# Altium schematic sheet ADC_LED_Monitor.SchDoc: ADC Led Monitor
size Tabloid; Date: 05/10/2023; Engineer: Terry D. Schevker; Revision: 1.0; SheetNumber: 2; SheetTotal: 7
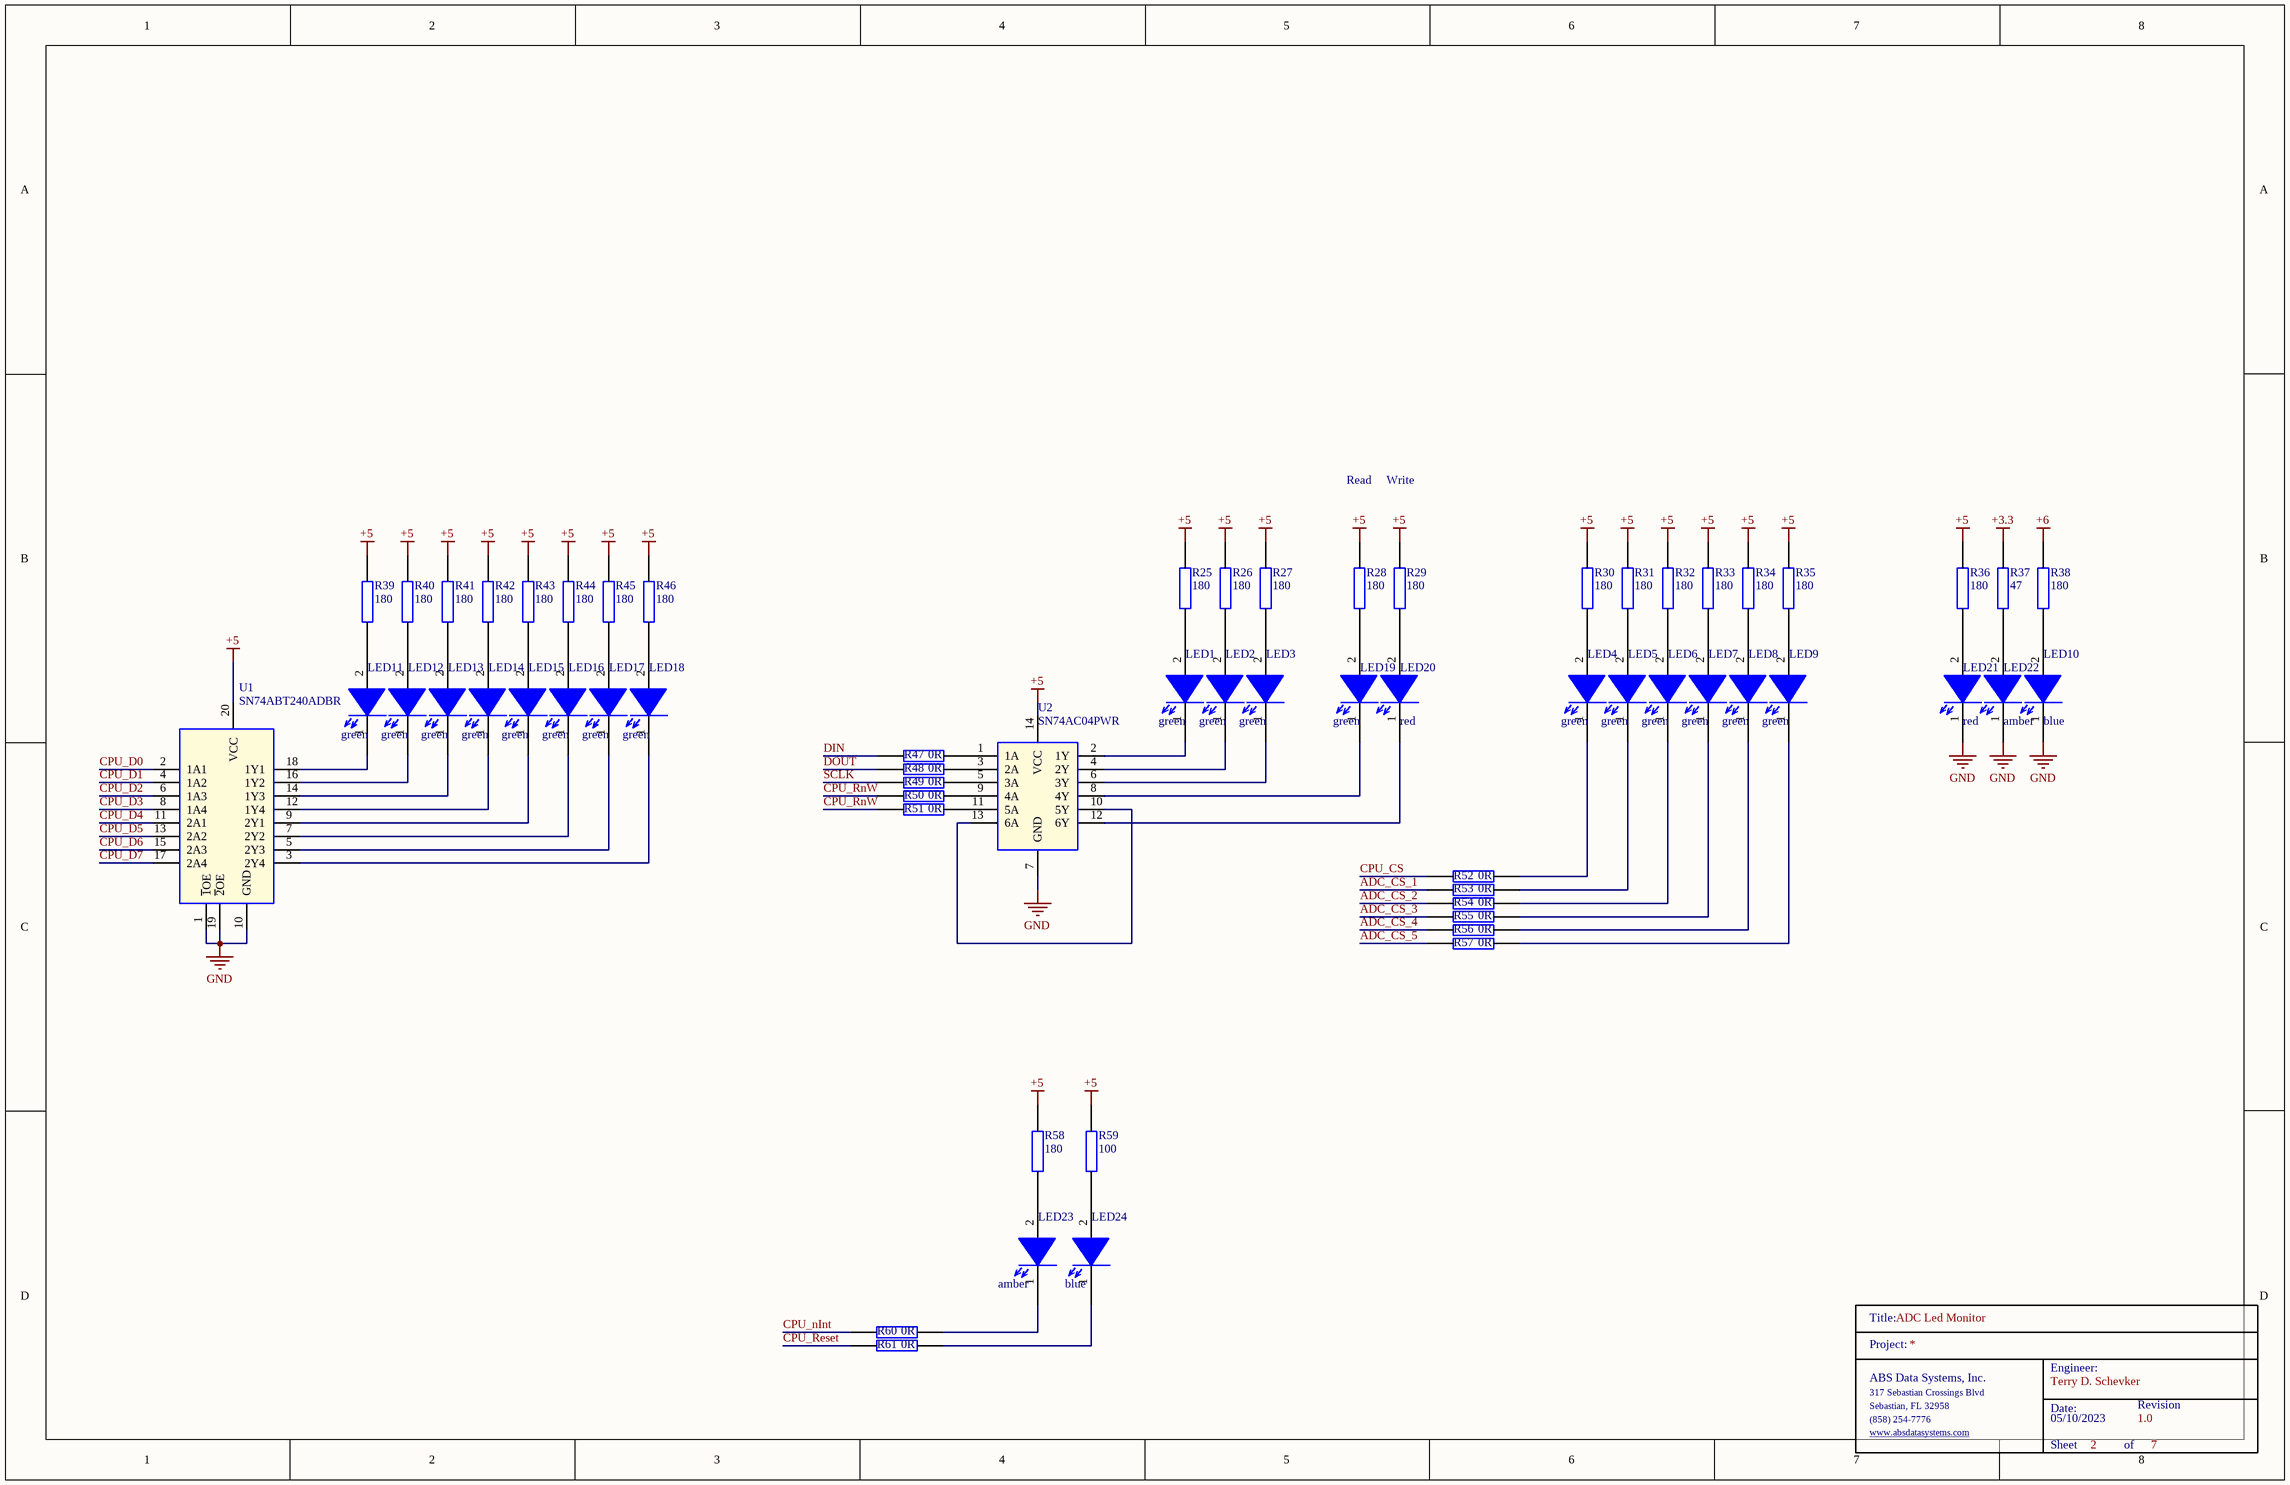
[diagram p0: ADC_LED_Monitor.SchDoc]

## Parts
LED1  green  [0603_Diode]
LED2  green  [0603_Diode]
LED3  green  [0603_Diode]
LED4  green  [0603_Diode]
LED5  green  [0603_Diode]
LED6  green  [0603_Diode]
LED7  green  [0603_Diode]
LED8  green  [0603_Diode]
LED9  green  [0603_Diode]
LED10  blue  [0603_Diode]
LED11  green  [0603_Diode]
LED12  green  [0603_Diode]
LED13  green  [0603_Diode]
LED14  green  [0603_Diode]
LED15  green  [0603_Diode]
LED16  green  [0603_Diode]
LED17  green  [0603_Diode]
LED18  green  [0603_Diode]
LED19  green  [0603_Diode]
LED20  red  [0603_Diode]
LED21  red  [0603_Diode]
LED22  amber  [0603_Diode]
LED23  amber  [0603_Diode]
LED24  blue  [0603_Diode]
R25  180  [0603]
R26  180  [0603]
R27  180  [0603]
R28  180  [0603]
R29  180  [0603]
R30  180  [0603]
R31  180  [0603]
R32  180  [0603]
R33  180  [0603]
R34  180  [0603]
R35  180  [0603]
R36  180  [0603]
R37  47  [0603]
R38  180  [0603]
R39  180  [0603]
R40  180  [0603]
R41  180  [0603]
R42  180  [0603]
R43  180  [0603]
R44  180  [0603]
R45  180  [0603]
R46  180  [0603]
R47  0R  [0603]
R48  0R  [0603]
R49  0R  [0603]
R50  0R  [0603]
R51  0R  [0603]
R52  0R  [0603]
R53  0R  [0603]
R54  0R  [0603]
R55  0R  [0603]
R56  0R  [0603]
R57  0R  [0603]
R58  180  [0603]
R59  100  [0603]
R60  0R  [0603]
R61  0R  [0603]
TitleBlock_2  TitleBlock  (value not drawn)  (graphical)
U1  SN74ABT240ADBR  [SOP65P780X200-20N]
U2  SN74AC04PWR  [SOP65P640X120-14N]

## Nets
+3.3: R37.1
+5: R25.2 R26.2 R27.2 R28.2 R29.2 R30.2 R31.2 R32.2 R33.2 R34.2 R35.2 R36.2 R39.2 R40.2 R41.2 R42.2 R43.2 R44.2 R45.2 R46.2 R58.2 R59.1 U1.20(VCC) U2.14(VCC)
+6: R38.2
GND: LED10.1(K) LED21.1(K) LED22.1(K) U1.1(~{1}OE) U1.10(GND) U1.19(~{2}OE) U2.7(GND)
ADC_CS_1: R53.1
ADC_CS_2: R54.1
ADC_CS_3: R55.1
ADC_CS_4: R56.1
ADC_CS_5: R57.1
CPU_CS: R52.1
CPU_D0: U1.2(1A1)
CPU_D1: U1.4(1A2)
CPU_D2: U1.6(1A3)
CPU_D3: U1.8(1A4)
CPU_D4: U1.11(2A1)
CPU_D5: U1.13(2A2)
CPU_D6: U1.15(2A3)
CPU_D7: U1.17(2A4)
CPU_nInt: R60.1
CPU_Reset: R61.1
CPU_RnW: R50.1 R51.1
DIN: R47.1
DOUT: R48.1
SCLK: R49.1
NetLED1_1: LED1.1(K) U2.2(1Y)
NetLED1_2: LED1.2(A) R25.1
NetLED2_1: LED2.1(K) U2.4(2Y)
NetLED2_2: LED2.2(A) R26.1
NetLED3_1: LED3.1(K) U2.6(3Y)
NetLED3_2: LED3.2(A) R27.1
NetLED4_1: LED4.1(K) R52.2
NetLED4_2: LED4.2(A) R30.1
NetLED5_1: LED5.1(K) R53.2
NetLED5_2: LED5.2(A) R31.1
NetLED6_1: LED6.1(K) R54.2
NetLED6_2: LED6.2(A) R32.1
NetLED7_1: LED7.1(K) R55.2
NetLED7_2: LED7.2(A) R33.1
NetLED8_1: LED8.1(K) R56.2
NetLED8_2: LED8.2(A) R34.1
NetLED9_1: LED9.1(K) R57.2
NetLED9_2: LED9.2(A) R35.1
NetLED10_2: LED10.2(A) R38.1
NetLED11_1: LED11.1(K) U1.18(1Y1)
NetLED11_2: LED11.2(A) R39.1
NetLED12_1: LED12.1(K) U1.16(1Y2)
NetLED12_2: LED12.2(A) R40.1
NetLED13_1: LED13.1(K) U1.14(1Y3)
NetLED13_2: LED13.2(A) R41.1
NetLED14_1: LED14.1(K) U1.12(1Y4)
NetLED14_2: LED14.2(A) R42.1
NetLED15_1: LED15.1(K) U1.9(2Y1)
NetLED15_2: LED15.2(A) R43.1
NetLED16_1: LED16.1(K) U1.7(2Y2)
NetLED16_2: LED16.2(A) R44.1
NetLED17_1: LED17.1(K) U1.5(2Y3)
NetLED17_2: LED17.2(A) R45.1
NetLED18_1: LED18.1(K) U1.3(2Y4)
NetLED18_2: LED18.2(A) R46.1
NetLED19_1: LED19.1(K) U2.8(4Y)
NetLED19_2: LED19.2(A) R28.1
NetLED20_1: LED20.1(K) U2.12(6Y)
NetLED20_2: LED20.2(A) R29.1
NetLED21_2: LED21.2(A) R36.1
NetLED22_2: LED22.2(A) R37.2
NetLED23_1: LED23.1(K) R60.2
NetLED23_2: LED23.2(A) R58.1
NetLED24_1: LED24.1(K) R61.2
NetLED24_2: LED24.2(A) R59.2
NetR47_2: R47.2 U2.1(1A)
NetR48_2: R48.2 U2.3(2A)
NetR49_2: R49.2 U2.5(3A)
NetR50_2: R50.2 U2.9(4A)
NetR51_2: R51.2 U2.11(5A)
NetU2_10: U2.10(5Y) U2.13(6A)

## Notes on the sheet
- Read
- Write
- (in symbol TitleBlock) Title:; Project:; Engineer:; ABS Data Systems, Inc.; 317 Sebastian Crossings Blvd; Sebastian, FL 32958; Date:; Revision; (858) 254-7776; www.absdatasystems.com; Sheet; of

## Library data of the parts
LED1-LED9 LED11-LED19 = 150060GS75000: Wurth Elektronik 0603 green; Manufacturer: Wurth Electronics; Wavelength: 520nm; Viewing Angle: 140°; Lens Style: Clear,Rectangular; Luminous Intensity: 430mcd; Forward Current: 30mA; Forward Voltage: 3.2V; Test Current: 20mA; Supplier 1: Digi-Key; Manufacturer Part Number: 150060GS75000; RoHS: Yes; Category: LEDs; Stock 1: 71509; Pricing 1: 1=0.14000, 50=0.13300, 100=0.11400, 500=0.09900 (USD); Mount: Surface Mount; Case/Package: 0603; Color: Green; Case Code (Metric): 1608; Case Code (Imperial): 0603; Min Operating Temperature: -40°C; Max Operating Temperature: 85°C; Package Quantity: 4000; Packaging: Tape and Reel; Dominant Wavelength: 520nm; Length: 1.6mm; Width: 0.8mm; Height: 0.7mm; REACH SVHC: Unknown; Lead Free: Lead Free; ComponentLink1URL: https://datasheet.ciiva.com/29562/150060gs75000-29562868.pdf?src-supplier=Digi-Key; ComponentLink1Description: https://datasheet.ciiva.com/29562/150060gs75000-29562868.pdf?src-supplier=Digi-Key; ComponentLink2URL: https://datasheet.ciiva.com/29279/759427-da-01-en-chipled-0603-w-kl-gruen-150060gs75000-29279201.pdf?src-supplier=Conrad; ComponentLink2Description: https://datasheet.ciiva.com/29279/759427-da-01-en-chipled-0603-w-kl-gruen-150060gs75000-29279201.pdf?src-supplier=Conrad; ComponentLink3URL: https://datasheet.ciiva.com/29562/150060gs75000-29562869.pdf?src-supplier=Digi-Key; ComponentLink3Description: https://datasheet.ciiva.com/29562/150060gs75000-29562869.pdf?src-supplier=Digi-Key; ComponentLink4URL: https://datasheet.ciiva.com/29562/150060gs75000-29562870.pdf?src-supplier=Digi-Key; ComponentLink4Description: https://datasheet.ciiva.com/29562/150060gs75000-29562870.pdf?src-supplier=Digi-Key
LED10 LED24 = 150060BS75000: Wurth Elektronik 0603 blue; Manufacturer: Wurth Electronics; Manufacturer Part Number: 150060GS75000; Color: Green; Wavelength: 520nm; Viewing Angle: 140°; Lens Style: Clear,Rectangular; Luminous Intensity: 430mcd; Forward Current: 30mA; Forward Voltage: 3.2V; Test Current: 20mA; Supplier 1: Digi-Key; RoHS: Yes; Category: LEDs; Stock 1: 71509; Pricing 1: 1=0.14000, 50=0.13300, 100=0.11400, 500=0.09900 (USD); Mount: Surface Mount; Case/Package: 0603; Case Code (Metric): 1608; Case Code (Imperial): 0603; Min Operating Temperature: -40°C; Max Operating Temperature: 85°C; Package Quantity: 4000; Packaging: Tape and Reel; Dominant Wavelength: 520nm; Length: 1.6mm; Width: 0.8mm; Height: 0.7mm; REACH SVHC: Unknown; Lead Free: Lead Free; ComponentLink1URL: https://datasheet.ciiva.com/29562/150060gs75000-29562868.pdf?src-supplier=Digi-Key; ComponentLink1Description: https://datasheet.ciiva.com/29562/150060gs75000-29562868.pdf?src-supplier=Digi-Key; ComponentLink2URL: https://datasheet.ciiva.com/29279/759427-da-01-en-chipled-0603-w-kl-gruen-150060gs75000-29279201.pdf?src-supplier=Conrad; ComponentLink2Description: https://datasheet.ciiva.com/29279/759427-da-01-en-chipled-0603-w-kl-gruen-150060gs75000-29279201.pdf?src-supplier=Conrad; ComponentLink3URL: https://datasheet.ciiva.com/29562/150060gs75000-29562869.pdf?src-supplier=Digi-Key; ComponentLink3Description: https://datasheet.ciiva.com/29562/150060gs75000-29562869.pdf?src-supplier=Digi-Key; ComponentLink4URL: https://datasheet.ciiva.com/29562/150060gs75000-29562870.pdf?src-supplier=Digi-Key; ComponentLink4Description: https://datasheet.ciiva.com/29562/150060gs75000-29562870.pdf?src-supplier=Digi-Key
LED20 LED21 = 150060RS75000: Wurth Elektronik 0603 red; Manufacturer: Wurth Electronics; Manufacturer Part Number: 150060GS75000; Color: Green; Wavelength: 520nm; Viewing Angle: 140°; Lens Style: Clear,Rectangular; Luminous Intensity: 430mcd; Forward Current: 30mA; Forward Voltage: 3.2V; Test Current: 20mA; Supplier 1: Digi-Key; RoHS: Yes; Category: LEDs; Stock 1: 71509; Pricing 1: 1=0.14000, 50=0.13300, 100=0.11400, 500=0.09900 (USD); Mount: Surface Mount; Case/Package: 0603; Case Code (Metric): 1608; Case Code (Imperial): 0603; Min Operating Temperature: -40°C; Max Operating Temperature: 85°C; Package Quantity: 4000; Packaging: Tape and Reel; Dominant Wavelength: 520nm; Length: 1.6mm; Width: 0.8mm; Height: 0.7mm; REACH SVHC: Unknown; Lead Free: Lead Free; ComponentLink1URL: https://datasheet.ciiva.com/29562/150060gs75000-29562868.pdf?src-supplier=Digi-Key; ComponentLink1Description: https://datasheet.ciiva.com/29562/150060gs75000-29562868.pdf?src-supplier=Digi-Key; ComponentLink2URL: https://datasheet.ciiva.com/29279/759427-da-01-en-chipled-0603-w-kl-gruen-150060gs75000-29279201.pdf?src-supplier=Conrad; ComponentLink2Description: https://datasheet.ciiva.com/29279/759427-da-01-en-chipled-0603-w-kl-gruen-150060gs75000-29279201.pdf?src-supplier=Conrad; ComponentLink3URL: https://datasheet.ciiva.com/29562/150060gs75000-29562869.pdf?src-supplier=Digi-Key; ComponentLink3Description: https://datasheet.ciiva.com/29562/150060gs75000-29562869.pdf?src-supplier=Digi-Key; ComponentLink4URL: https://datasheet.ciiva.com/29562/150060gs75000-29562870.pdf?src-supplier=Digi-Key; ComponentLink4Description: https://datasheet.ciiva.com/29562/150060gs75000-29562870.pdf?src-supplier=Digi-Key
LED22 LED23 = 150060AS75000: Wurth Elektronik 0603 amber; Manufacturer: Wurth Electronics; Manufacturer Part Number: 150060GS75000; Color: Green; Wavelength: 520nm; Viewing Angle: 140°; Lens Style: Clear,Rectangular; Luminous Intensity: 430mcd; Forward Current: 30mA; Forward Voltage: 3.2V; Test Current: 20mA; Supplier 1: Digi-Key; RoHS: Yes; Category: LEDs; Stock 1: 71509; Pricing 1: 1=0.14000, 50=0.13300, 100=0.11400, 500=0.09900 (USD); Mount: Surface Mount; Case/Package: 0603; Case Code (Metric): 1608; Case Code (Imperial): 0603; Min Operating Temperature: -40°C; Max Operating Temperature: 85°C; Package Quantity: 4000; Packaging: Tape and Reel; Dominant Wavelength: 520nm; Length: 1.6mm; Width: 0.8mm; Height: 0.7mm; REACH SVHC: Unknown; Lead Free: Lead Free; ComponentLink1URL: https://datasheet.ciiva.com/29562/150060gs75000-29562868.pdf?src-supplier=Digi-Key; ComponentLink1Description: https://datasheet.ciiva.com/29562/150060gs75000-29562868.pdf?src-supplier=Digi-Key; ComponentLink2URL: https://datasheet.ciiva.com/29279/759427-da-01-en-chipled-0603-w-kl-gruen-150060gs75000-29279201.pdf?src-supplier=Conrad; ComponentLink2Description: https://datasheet.ciiva.com/29279/759427-da-01-en-chipled-0603-w-kl-gruen-150060gs75000-29279201.pdf?src-supplier=Conrad; ComponentLink3URL: https://datasheet.ciiva.com/29562/150060gs75000-29562869.pdf?src-supplier=Digi-Key; ComponentLink3Description: https://datasheet.ciiva.com/29562/150060gs75000-29562869.pdf?src-supplier=Digi-Key; ComponentLink4URL: https://datasheet.ciiva.com/29562/150060gs75000-29562870.pdf?src-supplier=Digi-Key; ComponentLink4Description: https://datasheet.ciiva.com/29562/150060gs75000-29562870.pdf?src-supplier=Digi-Key
R25-R36 R38-R46 R58 = RC0603FR-13180RL: YAGEO 0603 180 ohm; Manufacturer_Name: KEMET; Manufacturer_Part_Number: RC0603JR-070RL; Geometry.Height: 0.55mm; Mouser Part Number: 603-RC0603JR-070RL; Mouser Price/Stock: https://www.mouser.co.uk/ProductDetail/YAGEO/RC0603JR-070RL?qs=2cAdsCoAWRGWyPcuXgGiXQ%3D%3D; Datasheet Link: https://datasheet.datasheetarchive.com/originals/distributors/Datasheets_SAMA/902f9e387b938f871d31120f5fc1d65e.pdf
R37 = RC0603FR-0747KL: YAGEO 0603 47; Manufacturer_Name: KEMET; Manufacturer_Part_Number: RC0603JR-070RL; Geometry.Height: 0.55mm; Mouser Part Number: 603-RC0603JR-070RL; Mouser Price/Stock: https://www.mouser.co.uk/ProductDetail/YAGEO/RC0603JR-070RL?qs=2cAdsCoAWRGWyPcuXgGiXQ%3D%3D; Datasheet Link: https://datasheet.datasheetarchive.com/originals/distributors/Datasheets_SAMA/902f9e387b938f871d31120f5fc1d65e.pdf
R47-R57 R60 R61 = RC0603JR-070RL: YAGEO 0603 0 ohm; Manufacturer_Name: KEMET; Geometry.Height: 0.55mm; Mouser Part Number: 603-RC0603JR-070RL; Mouser Price/Stock: https://www.mouser.co.uk/ProductDetail/YAGEO/RC0603JR-070RL?qs=2cAdsCoAWRGWyPcuXgGiXQ%3D%3D; Manufacturer_Part_Number: RC0603JR-070RL; Datasheet Link: https://datasheet.datasheetarchive.com/originals/distributors/Datasheets_SAMA/902f9e387b938f871d31120f5fc1d65e.pdf
R59 = RC0603FR-10100RL: YAGEO 0603 100 ohm; Manufacturer_Name: KEMET; Manufacturer_Part_Number: RC0603JR-070RL; Geometry.Height: 0.55mm; Mouser Part Number: 603-RC0603JR-070RL; Mouser Price/Stock: https://www.mouser.co.uk/ProductDetail/YAGEO/RC0603JR-070RL?qs=2cAdsCoAWRGWyPcuXgGiXQ%3D%3D; Datasheet Link: https://datasheet.datasheetarchive.com/originals/distributors/Datasheets_SAMA/902f9e387b938f871d31120f5fc1d65e.pdf
U1 = SN74ABT240ADBR: Octal Buffers/Drivers With 3-State Outputs; Manufacturer_Name: Texas Instruments; Geometry.Height: 2mm; Mouser Part Number: 595-SN74ABT240ADBR; Mouser Price/Stock: https://www.mouser.co.uk/ProductDetail/Texas-Instruments/SN74ABT240ADBR?qs=JHHQeKcAU3Dt82k%252BVyiYdw%3D%3D; Manufacturer_Part_Number: SN74ABT240ADBR; Datasheet Link: http://www.ti.com/lit/gpn/sn74abt240a
U2 = SN74AC04PWR: Hex Inverters; Manufacturer_Name: Texas Instruments; Geometry.Height: 1.2mm; Mouser Part Number: 595-SN74AC04PWR; Mouser Price/Stock: https://www.mouser.co.uk/ProductDetail/Texas-Instruments/SN74AC04PWR?qs=RZS%252BpEsUn7pRvPNqsga4SA%3D%3D; Manufacturer_Part_Number: SN74AC04PWR; Datasheet Link: http://www.ti.com/lit/gpn/sn74ac04